# Altium schematic sheet front-panel.SchDoc: ESP32-web-radio Front panel
size A4; Engineer: CT; SheetNumber: 1; SheetTotal: 1
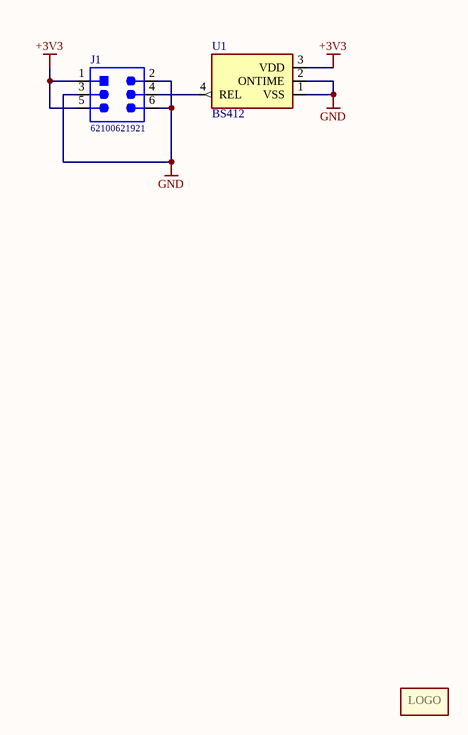
[diagram p0: front-panel.SchDoc]

## Parts
J1  62100621921  [62100621921]
M1  Logo  [LOGO_9x6mm]  (value not drawn)  (no BOM)
U1  BS412  [BS412-Footprint-1]

## Nets
+3V3: J1.1 J1.5 U1.3(VDD)
GND: J1.2 J1.3 J1.6 U1.1(VSS) U1.2(ONTIME)
NetJ1_4: J1.4 U1.4(REL)

## Notes on the sheet
- Title
- Sheet Revision:
- Link:
- Size:
- Project:
- Engineer:
- A4
- Date:
- Sheet
- of
- File:
- (in symbol Logo) LOGO

## Library data of the parts
J1 = CMP-045-000367-4: WR-PHD Pin Header, SMT, pitch 2mm, Dual Row, Vertical, 6p; Manufacturer: Wurth Elektronik; Rated Current: 2A; Contact Resistance: 20mOhm; Pin Number: 6; Withstanding Voltage: 500VAC; Working Voltage: 200VAC; ComponentLink1Description: Manufacturer; Design Item ID: 62100621921; Gender: Pin Header; Pin Count: 6; ComponentLink1URL: http://www.we-online.de; Orientation: Vertical; Packaging: Tube; Operating Temperature: -40 to +105degC; ComponentLink2URL: https://www.we-online.com/catalog/datasheet/62100621921.pdf; Pitch: 2mm; Component Type: Standard; ComponentLink2Description: Datasheet; Row Number: Dual; Manufacturer Part Number: 62100621921; Source: WR-PHD_Pin Header.SchLib; Mounting Technology: SMT; JLCPCB Part #: C3294482
U1 = CMP-001-0045-3: Mini Basic PIR Sensor - BS412; JLCPCB Part #: C410378